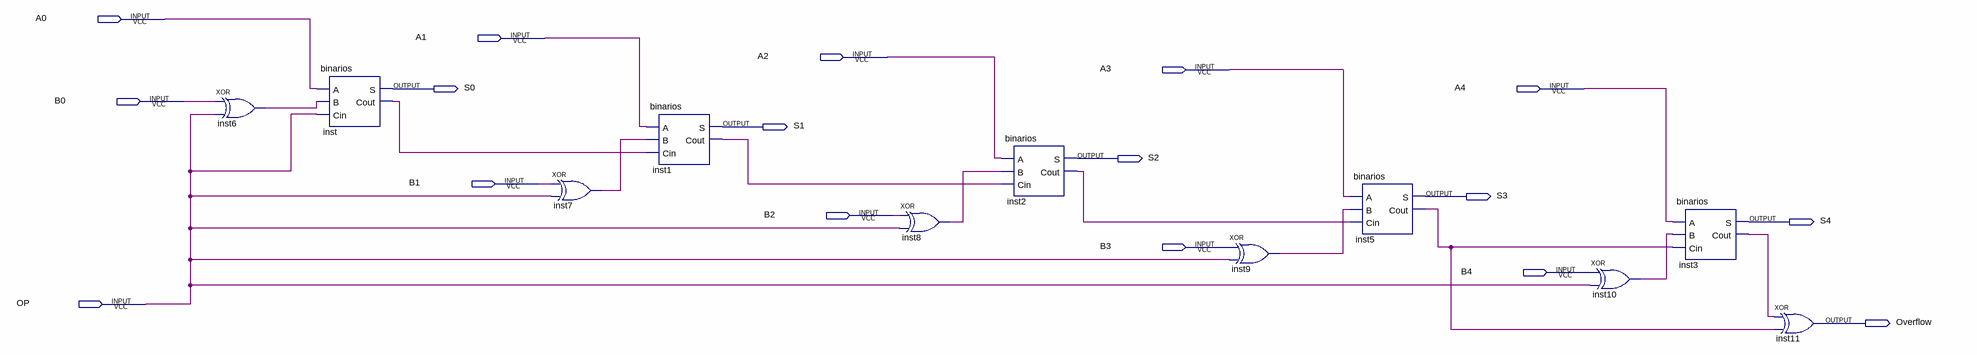
[diagram p0: schematic sheet]
// Quartus schematic projeto_soma_subtrai.bdf as structural Verilog: 11 symbols, 17 pins
module projeto_soma_subtrai (
  input  A0,
  input  A1,
  input  A2,
  input  A3,
  input  A4,
  input  B0,
  input  B1,
  input  B2,
  input  B3,
  input  B4,
  input  OP,
  output S0,
  output S1,
  output S2,
  output S3,
  output S4,
  output Overflow
);

  wire inst1_cout, inst2_cout, inst3_cout, inst5_cout, inst6_out, inst7_out, inst8_out, inst9_out,
       inst10_out, inst_cout;

  xor inst6 (inst6_out, B0, OP);
  binarios inst (.A(A0), .B(inst6_out), .Cin(OP), .S(S0), .Cout(inst_cout));
  xor inst7 (inst7_out, B1, OP);
  binarios inst1 (.A(A1), .B(inst7_out), .Cin(inst_cout), .S(S1), .Cout(inst1_cout));
  xor inst8 (inst8_out, B2, OP);
  binarios inst2 (.A(A2), .B(inst8_out), .Cin(inst1_cout), .S(S2), .Cout(inst2_cout));
  xor inst9 (inst9_out, B3, OP);
  binarios inst5 (.A(A3), .B(inst9_out), .Cin(inst2_cout), .S(S3), .Cout(inst5_cout));
  xor inst10 (inst10_out, B4, OP);
  binarios inst3 (.A(A4), .B(inst10_out), .Cin(inst5_cout), .S(S4), .Cout(inst3_cout));
  xor inst11 (Overflow, inst3_cout, inst5_cout);
endmodule
